# Altium schematic sheet TIDA-010056_Page1.SchDoc (part 2 of 2)
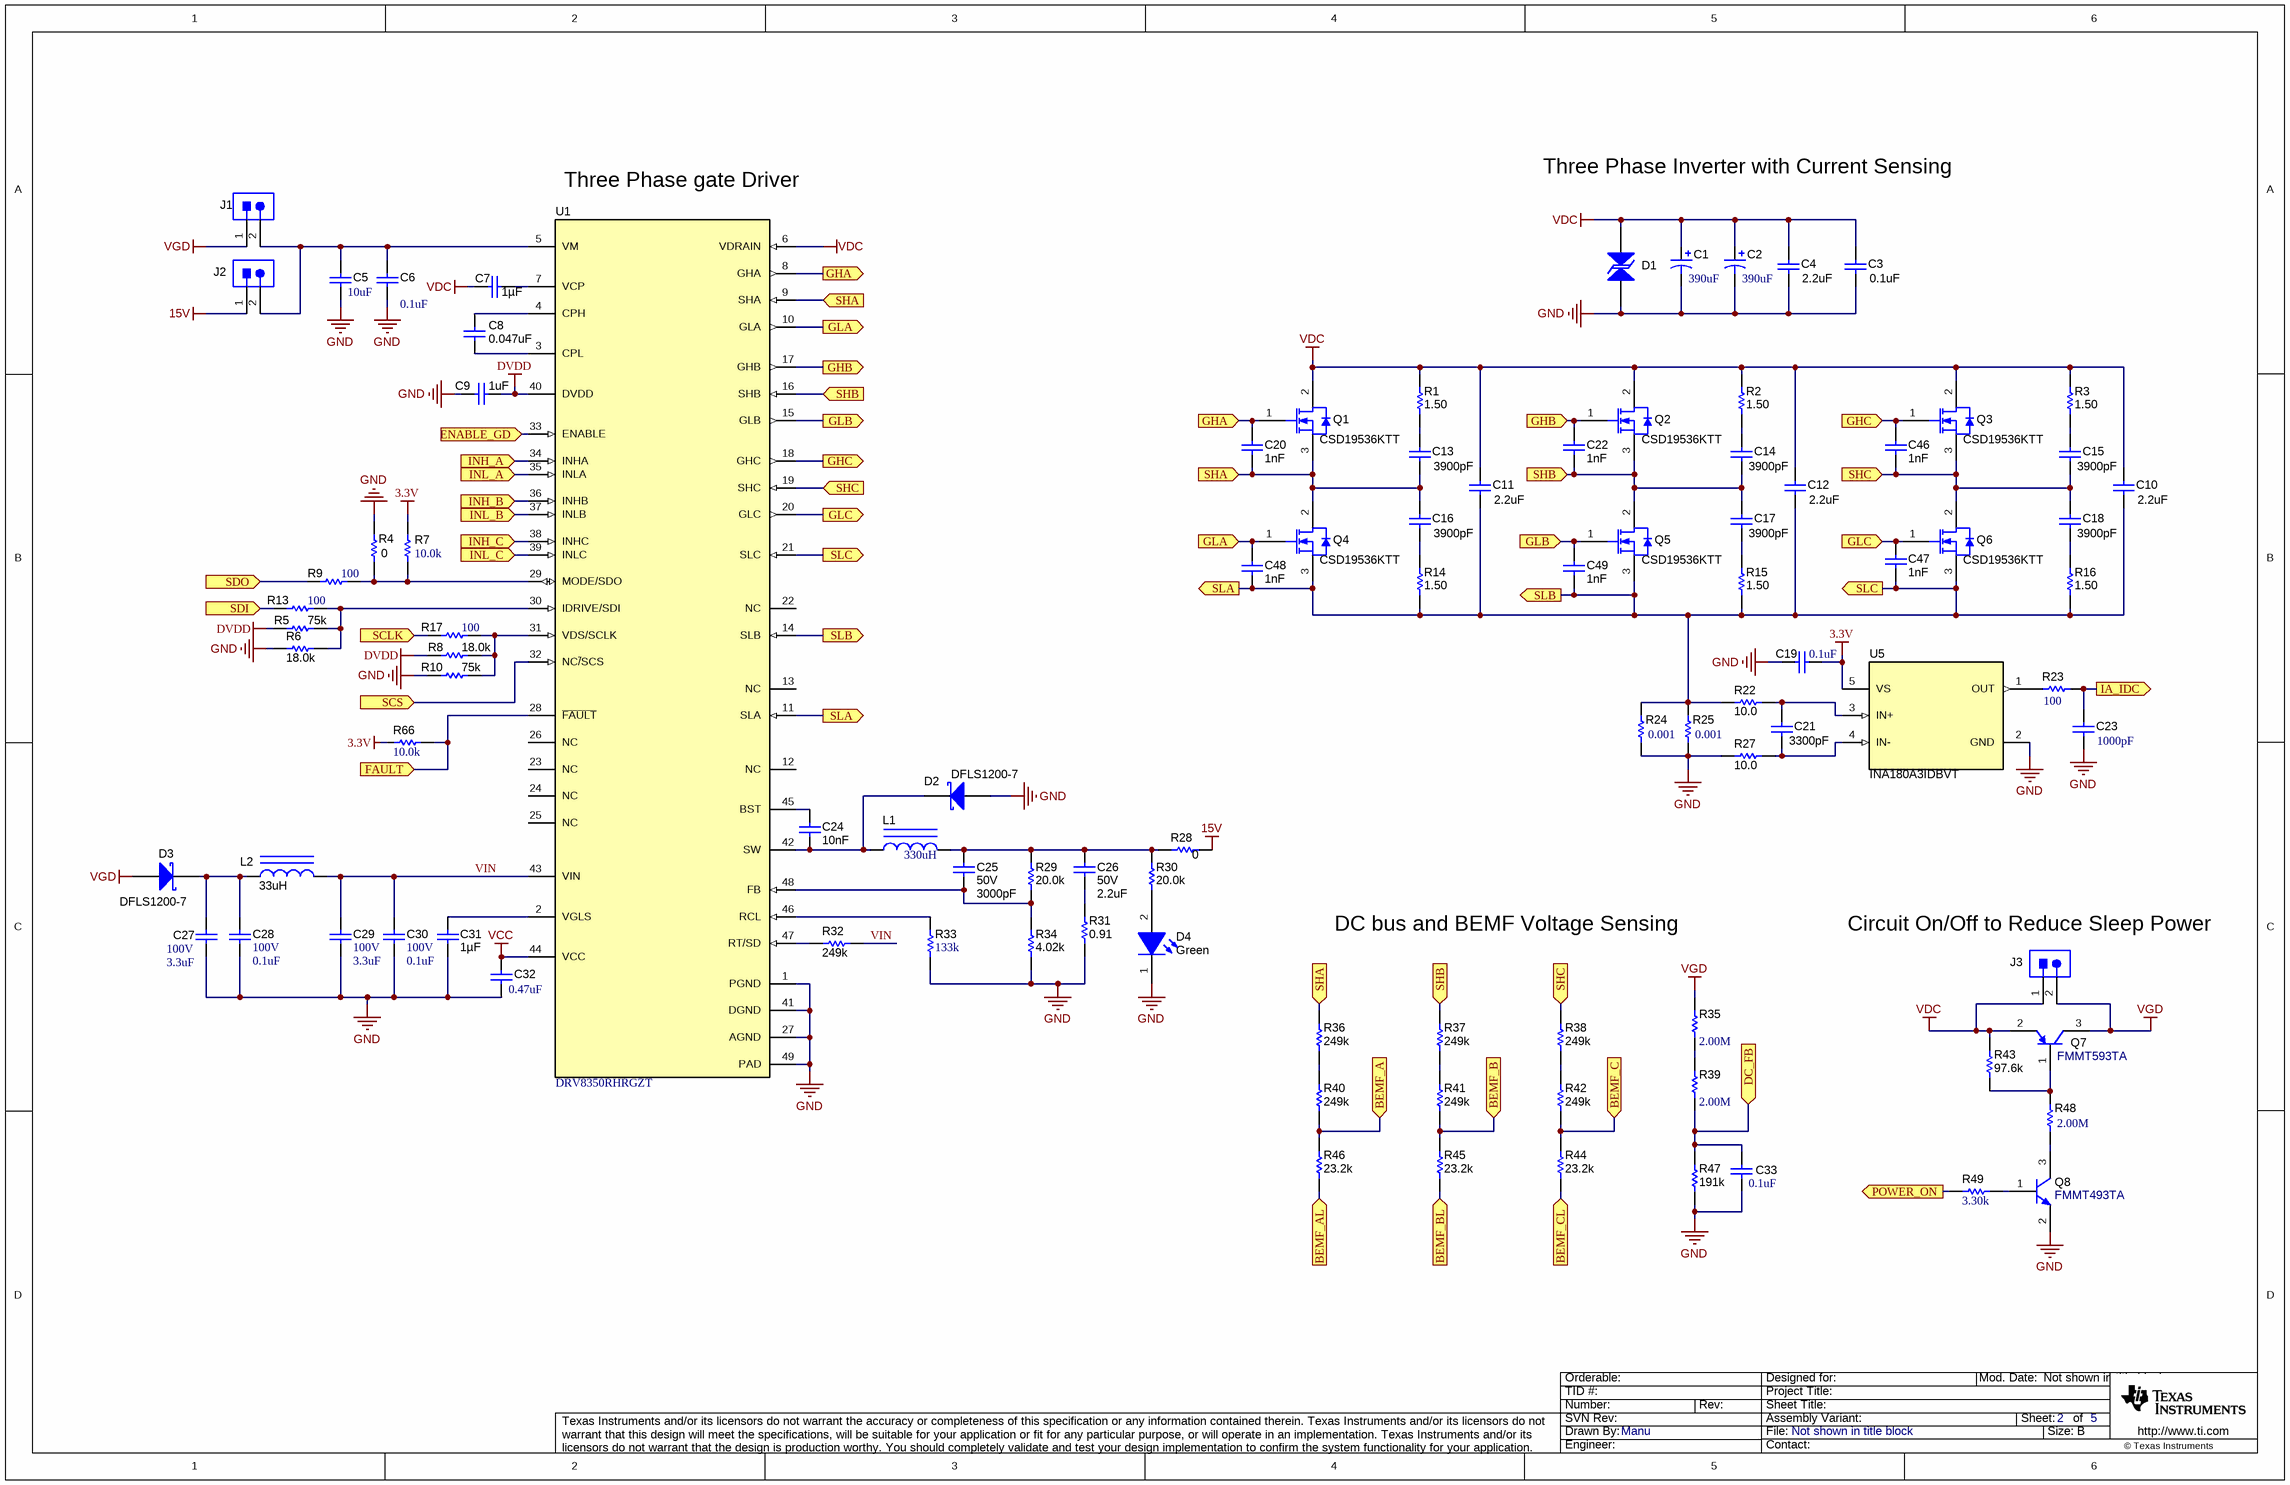
[diagram p1: TIDA-010056_Page1.SchDoc]

## Library data of the parts
C1 C2 = CMP-0009783-2: CAP ALUM 390UF 20% 100V THRUHOLE; Manufacturer: Panasonic Electronic Components; TaMin_C: -40°C; ESR_ohm: 0.025; Polarized: Y; SizeAreaWB_mm2: 324; Value1: 0.025 ohm; U/M: EA; TaMax_C: 105°C; SizeZ_mm: 27; SizeX_mm: 16; Cap_Case: 16x257; SizeArea_mm2: 256; CompType: Capacitor; AEC Qualified: N; Cap_F: 390µF; IRMS_A: 2.5A; AEC Category: Q200; Publisher: Texas Instruments; Supplier 2: Newark; Supplier 3: Farnell; RoHS: Y; MountType: TH; Value: 390uF; Supplier 1: Digi-Key; PackageReference: D16xL27mm; Tolerance_%: 20%; SizeY_mm: 16; Value2: 100V; LatestRevisionDate: 2017-03-09; PartNumber: EEU-FS2A391; Series: YXJ; VDC_V: 100V; ComponentLink1Description: Datasheet link; AEC Grade: N/A; Supplier Part Number 1: PCE5237-ND; Technology: AL; ComponentLink1URL: http://www.rubycon.co.jp/en/catalog/e_pdfs/aluminum/e_yxj.pdf; Parameter 1: *
C3 = CMP-0008709-2: CAP, CERM, 0.1 uF, 100 V, +/- 10%, X7R, 1206; Manufacturer: TDK; TaMin_C: -55°C; ESR_ohm: 0.030343; Polarized: N; SizeAreaWB_mm2: 10.92; Value1: 0.030343 ohm; U/M: EA; Value: 0.1uF; TaMax_C: 125°C; SizeZ_mm: 1.8; SizeX_mm: 3.2; SizeY_mm: 1.6; Value2: 100V; SizeArea_mm2: 5.12; Cap_F: 100nF; IRMS_A: 1.33802A; AEC Category: Q200; Supplier Part Number 2: 810-C3216X7R2A104K160AA; Publisher: Texas Instruments; Supplier 2: Mouser; TempCo: X7R; Published: 2008-06-19; RoHS: Y; MountType: SMT; Supplier 1: Digi-Key; PackageReference: 1206; Tolerance_%: 10%; Cap_Case: 1206_180; CompType: Capacitor; LatestRevisionDate: 2017-03-09; PartNumber: C3216X7R2A104K160AA; AEC Qualified: N; VDC_V: 100V; ComponentLink1Description: Datasheet link; AEC Grade: N/A; Supplier Part Number 1: 445-1377-1-ND; Technology: Ceramic; ComponentLink1URL: https://product.tdk.com/en/search/capacitor/ceramic/mlcc/info?part_no=C3216X7R2A104K160AA
C4 C10-C12 = CMP-0008756-2: CAP CER 2.2UF 100V X7R 1206; Manufacturer: Samsung Electro-Mechanics; TaMin_C: -55°C; Polarized: N; SizeAreaWB_mm2: 10.92; Value1: Unknown; U/M: EA; TaMax_C: 125°C; Tolerance_%: 10%; SizeZ_mm: 1.35; SizeX_mm: 3.2; SizeY_mm: 1.6; SizeArea_mm2: 5.12; AEC Category: Q200; Publisher: Texas Instruments; Supplier 2: Mouser; TempCo: X7R; Supplier 3: Farnell; Published: 2008-06-19; RoHS: Y; MountType: SMT; Value: 2.2uF; Supplier 1: Digi-Key; PackageReference: 1206; Cap_Case: 1206; Value2: 100V; CompType: Capacitor; LatestRevisionDate: 2017-03-09; PartNumber: CL31B225KCHSNNE; AEC Qualified: ?; Cap_F: 2.2uF; VDC_V: 100V; ComponentLink1Description: Datasheet link; Supplier Part Number 1: 1276-3138-1-ND; Technology: Ceramic; ComponentLink1URL: http://www.yageo.com/documents/recent/UPY-GPHC_X7R_6.3V-to-50V_7.pdf
C5 = CMP-0009304-2: CAP, CERM, 10 uF, 100 V, +/- 20%, X7R, 2220; Manufacturer: AVX; TaMin_C: -55°C; Polarized: N; SizeAreaWB_mm2: 53.9; Value1: Unknown; U/M: EA; Value: 10uF; TaMax_C: 125°C; SizeZ_mm: 2.8; SizeX_mm: 5.7; SizeY_mm: 5; Cap_Case: 2220; Value2: 100V; SizeArea_mm2: 28.5; Cap_F: 10µF; AEC Category: Q200; Supplier Part Number 2: 581-22201C106MAT2A; Publisher: Texas Instruments; Supplier 2: Mouser; TempCo: X7R; Published: 2008-06-19; RoHS: Y; MountType: SMT; Supplier 1: Digi-Key; PackageReference: 2220; Tolerance_%: 20%; CompType: Capacitor; LatestRevisionDate: 2017-03-09; PartNumber: 22201C106MAT2A; AEC Qualified: N; ComponentLink1Description: Datasheet link; AEC Grade: N/A; Supplier Part Number 1: 478-9622-1-ND; Technology: Ceramic; ComponentLink1URL: http://datasheets.avx.com/X7RDielectric.pdf
C6 = CMP-0007469-4: CAP, CERM, 0.1 uF, 100 V, +/- 10%, X7R, 0603; Manufacturer: MuRata; TaMin_C: -55°C; Polarized: N; SizeAreaWB_mm2: 4.68; Value1: Unknown; U/M: EA; Value: 0.1uF; TaMax_C: 125°C; SizeZ_mm: 1; SizeX_mm: 1.6; SizeY_mm: 0.8; Value2: 100V; SizeArea_mm2: 1.28; Cap_F: 100nF; AEC Category: Q200; Supplier Part Number 2: 81-GRM188R72A104KA35; Publisher: Texas Instruments; Supplier 2: Mouser; Supplier Part Number 3: 1828921; TempCo: X7R; Supplier 3: Farnell; Published: 2008-06-19; RoHS: Y; MountType: SMT; Supplier 1: Digi-Key; PackageReference: 0603; Tolerance_%: 10%; Cap_Case: 0603; CompType: Capacitor; LatestRevisionDate: 2017-03-09; PartNumber: GRM188R72A104KA35D; AEC Qualified: ?; VDC_V: 100V; ComponentLink1Description: Datasheet link; Supplier Part Number 1: 490-3285-1-ND; Technology: Ceramic; ComponentLink1URL: http://search.murata.co.jp/Ceramy/PnsearchViewAction.do?HnOFG=ON&HnNFG=ON&SEL_CNT=50&sLang=en&sKey=GRM188R72A104KA35D&x=9&y=9&search=startwith
C7 C31 = CMP-0086009-1: CAP, CERM, 1 µF, 16 V,+/- 20%, X5R, 0402; Manufacturer: Samsung Electro-Mechanics; SizeX_mm: 1; AEC Qualified: N; TaMin_C: -55°C; Value2: 16V; SizeY_mm: 0.5; Value: 1uF; SizeAreaWB_mm2: 3; U/M: EA; AEC Category: Q200; TaMax_C: 85°C; SizeZ_mm: 0.6; Technology: Ceramic; Cap_Case: 0402; Polarized: N; TempCo: X5R; CompType: Capacitor; ComponentLink1URL: http://www.samsungsem.com/kr/support/library/product-catalog/__icsFiles/afieldfile/2018/11/28/MLCC.pdf; AEC Grade: N/A; ComponentLink1Description: Datasheet link; PackageReference: 0402; PartNumber: CL05A105MO5NNNC; Tolerance_%: 20%; SizeArea_mm2: 0.5; VDC_V: 16V; RoHS: Y; Cap_F: 1µF; MountType: SMT
C8 = CMP-0008373-2: CAP, CERM, 0.047 uF, 100 V, +/- 10%, X7R, 0805; Manufacturer: MuRata; TaMin_C: -55°C; Polarized: N; SizeAreaWB_mm2: 6.75; Value1: Unknown; U/M: EA; TaMax_C: 125°C; SizeZ_mm: 1.45; SizeX_mm: 2; SizeY_mm: 1.25; Cap_Case: 0805; Value2: 100V; SizeArea_mm2: 2.5; CompType: Capacitor; Cap_F: 47nF; AEC Category: Q200; Supplier Part Number 2: 81-GRM21BR72A473KA1L; Publisher: Texas Instruments; Supplier 2: Mouser; Supplier Part Number 3: 1403974; TempCo: X7R; Supplier 3: Farnell; Published: 2008-06-19; RoHS: Y; MountType: SMT; Value: 0.047uF; Supplier 1: Digi-Key; PackageReference: 0805; Tolerance_%: 10%; LatestRevisionDate: 2017-03-09; PartNumber: GRM21BR72A473KA01L; AEC Qualified: ?; VDC_V: 100V; ComponentLink1Description: Datasheet link; Supplier Part Number 1: 490-3325-1-ND; Technology: Ceramic; ComponentLink1URL: http://search.murata.co.jp/Ceramy/PnsearchViewAction.do?HnOFG=ON&HnNFG=ON&SEL_CNT=50&sLang=en&sKey=GRM21BR72A473KA01L&x=9&y=9&search=startwith
C9 = CMP-0006372-2: CAP, CERM, 1 uF, 6.3 V, +/- 20%, X5R, 0402; Manufacturer: MuRata; TaMin_C: -55°C; Polarized: N; SizeAreaWB_mm2: 3; Value1: Unknown; U/M: EA; Value: 1uF; TaMax_C: 85°C; SizeZ_mm: 0.6; SizeX_mm: 1; SizeY_mm: 0.5; Value2: 6.3V; CompType: Capacitor; Cap_F: 1µF; AEC Category: Q200; Supplier Part Number 2: 81-GRM152R60J105ME5D; Publisher: Texas Instruments; Supplier 2: Mouser; TempCo: X5R; Published: 2008-06-19; RoHS: Y; MountType: SMT; Supplier 1: Digi-Key; PackageReference: 0402; Tolerance_%: 20%; Cap_Case: 0402; SizeArea_mm2: 0.5; LatestRevisionDate: 2017-03-09; PartNumber: GRM152R60J105ME15D; AEC Qualified: ?; VDC_V: 6.3V; ComponentLink1Description: Datasheet link; Supplier Part Number 1: 490-10006-1-ND; Technology: Ceramic; ComponentLink1URL: http://psearch.murata.com/capacitor/product/GRM152R60J105ME15%23.pdf
C13-C18 = CMP-0008756-2: CAP CER 3900PF 100V X7R 1206; Manufacturer: AVX Corporation; TaMin_C: -55°C; Polarized: N; SizeAreaWB_mm2: 10.92; Value1: Unknown; U/M: EA; TaMax_C: 125°C; Tolerance_%: 10%; SizeZ_mm: 1.35; SizeX_mm: 3.2; SizeY_mm: 1.6; SizeArea_mm2: 5.12; Cap_F: 3.9nF; AEC Category: Q200; Publisher: Texas Instruments; Supplier 2: Mouser; TempCo: X7R; Supplier 3: Farnell; Published: 2008-06-19; RoHS: Y; MountType: SMT; Value: 3900pF; Supplier 1: Digi-Key; PackageReference: 1206; Cap_Case: 1206; Value2: 100V; CompType: Capacitor; LatestRevisionDate: 2017-03-09; PartNumber: 12061C392KAZ2A; AEC Qualified: ?; VDC_V: 100V; ComponentLink1Description: Datasheet link; Supplier Part Number 1: 478-6364-1-ND; Technology: Ceramic; ComponentLink1URL: http://www.yageo.com/documents/recent/UPY-GPHC_X7R_6.3V-to-50V_7.pdf
C19 C33 = CMP-0006350-2: CAP, CERM, 0.1 uF, 10 V, +/- 10%, X7R, AEC-Q200 Grade 1, 0402; Manufacturer: MuRata; TaMin_C: -55°C; Polarized: N; SizeAreaWB_mm2: 3; Value1: Unknown; U/M: EA; Value: 0.1uF; TaMax_C: 125°C; SizeZ_mm: 0.6; SizeX_mm: 1; SizeY_mm: 0.5; Value2: 10V; AEC Qualified: Y; Cap_F: 100nF; AEC Category: Q200; Publisher: Texas Instruments; TempCo: X7R; Published: 2008-06-19; RoHS: Y; MountType: SMT; Supplier 1: Mouser; PackageReference: 0402; Tolerance_%: 10%; Cap_Case: 0402; SizeArea_mm2: 0.5; CompType: Capacitor; LatestRevisionDate: 2017-03-09; PartNumber: GCM155R71A104KA55D; VDC_V: 10V; ComponentLink1Description: Datasheet link; AEC Grade: 1; Supplier Part Number 1: 81-GCM155R71A104K5D; Technology: Ceramic; ComponentLink1URL: http://search.murata.co.jp/Ceramy/image/img/A01X/G101/ENG/GCM155R71A104KA55-01.pdf
C20 C22 C46-C49 = CMP-0064933-1: CAP, CERM, 1000 pF, 50 V,+/- 10%, X7R, 0603; Manufacturer: Wurth Elektronik; TaMin_C: -55°C; Polarized: N; SizeAreaWB_mm2: 4.68; Value1: Unknown; U/M: EA; Value: 1000pF; TaMax_C: 125°C; SizeZ_mm: 1; SizeX_mm: 1.6; SizeY_mm: 0.8; Value2: 50V; SizeArea_mm2: 1.28; AEC Category: Q200; ComponentLink1URL: http://katalog.we-online.de/pbs/datasheet/885012206083.pdf; Supplier Part Number 2: 75Y6033; Publisher: Texas Instruments; Supplier 2: Newark; Supplier Part Number 3: 710-885012206083; TempCo: X7R; Supplier 3: Mouser; Published: 2008-06-19; RoHS: Y; MountType: SMT; Supplier 1: Digi-Key; PackageReference: 0603; Tolerance_%: 10%; Cap_Case: 0603; CompType: Capacitor; LatestRevisionDate: 2017-06-05; PartNumber: 885012206083; AEC Qualified: N; VDC_V: 50V; ComponentLink1Description: Datasheet link; AEC Grade: N/A; Supplier Part Number 1: 732-8001-1-ND; Technology: Ceramic; ValueDisplayed: 1000pF
C21 = CMP-0006688-2: CAP, CERM, 3300 pF, 50 V, +/- 10%, X7R, 0402; Manufacturer: MuRata; TaMin_C: -55°C; Polarized: N; SizeAreaWB_mm2: 3; Value1: Unknown; U/M: EA; Value: 3300pF; TaMax_C: 125°C; SizeZ_mm: 0.6; SizeX_mm: 1; SizeY_mm: 0.5; Value2: 50V; Cap_F: 3.3nF; AEC Category: Q200; Supplier Part Number 2: 81-GRM36X332K50; Publisher: Texas Instruments; Supplier 2: Mouser; TempCo: X7R; Published: 2008-06-19; RoHS: Y; MountType: SMT; Supplier 1: Digi-Key; PackageReference: 0402; Tolerance_%: 10%; Cap_Case: 0402; SizeArea_mm2: 0.5; CompType: Capacitor; LatestRevisionDate: 2017-03-09; PartNumber: GRM155R71H332KA01D; AEC Qualified: ?; VDC_V: 50V; ComponentLink1Description: Datasheet link; Supplier Part Number 1: 490-3248-1-ND; Technology: Ceramic; ComponentLink1URL: http://search.murata.co.jp/Ceramy/PnsearchViewAction.do?HnOFG=ON&HnNFG=ON&SEL_CNT=50&sLang=en&sKey=GRM155R71H332KA01D&x=9&y=9&search=startwith
C23 = CMP-0006638-2: CAP, CERM, 1000 pF, 16 V, +/- 10%, X7R, 0402; Manufacturer: MuRata; TaMin_C: -55°C; Polarized: N; SizeAreaWB_mm2: 3; Value1: Unknown; U/M: EA; Value: 1000pF; TaMax_C: 125°C; SizeZ_mm: 0.6; SizeX_mm: 1; SizeY_mm: 0.5; Value2: 16V; Cap_F: 1nF; AEC Category: Q200; Supplier Part Number 2: 81-GRM155R71C102KA1D; Publisher: Texas Instruments; Supplier 2: Mouser; TempCo: X7R; Published: 2008-06-19; RoHS: Y; MountType: SMT; Supplier 1: Digi-Key; PackageReference: 0402; Tolerance_%: 10%; Cap_Case: 0402; SizeArea_mm2: 0.5; CompType: Capacitor; LatestRevisionDate: 2017-03-09; PartNumber: GRM155R71C102KA01D; AEC Qualified: ?; VDC_V: 16V; ComponentLink1Description: Datasheet link; Supplier Part Number 1: GRM155R71C102KA01D-ND; Technology: Ceramic; ComponentLink1URL: http://search.murata.co.jp/Ceramy/PnsearchViewAction.do?HnOFG=ON&HnNFG=ON&SEL_CNT=50&sLang=en&sKey=GRM155R71C102KA01D&x=9&y=9&search=startwith
C24 = CMP-0079993-1: CAP, CERM, 0.01 µF, 100 V,+/- 10%, X7R, 0603; Manufacturer: Wurth Elektronik; TaMin_C: -55°C; Polarized: N; SizeAreaWB_mm2: 4.68; U/M: EA; Value: 0.01uF; TaMax_C: 105°C; SizeZ_mm: 1; SizeX_mm: 1.6; SizeY_mm: 0.8; Value2: 100V; SizeArea_mm2: 1.28; AEC Category: Q200; ValueDisplayed: 0.01µF; ComponentLink1URL: http://katalog.we-online.de/pbs/datasheet/885012206114.pdf; Supplier Part Number 2: 2812368; Supplier 2: Farnell; TempCo: X7R; RoHS: Y; MountType: SMT; Supplier 1: Newark; PackageReference: 0603; Tolerance_%: 10%; Cap_Case: 0603; CompType: Capacitor; PartNumber: 885012206114; AEC Qualified: N; VDC_V: 100V; ComponentLink1Description: Datasheet link; AEC Grade: N/A; Supplier Part Number 1: 45AC8565; Technology: Ceramic
C25 = CMP-0007207-4: CAP, CERM, 3000 pF, 50 V, +/- 5%, C0G/NP0, 0603; Manufacturer: MuRata; TaMin_C: -55°C; Polarized: N; SizeAreaWB_mm2: 4.68; Value1: Unknown; U/M: EA; Value: 3000pF; TaMax_C: 125°C; SizeZ_mm: 1; SizeX_mm: 1.6; SizeY_mm: 0.8; SizeArea_mm2: 1.28; Cap_F: 3nF; AEC Category: Q200; Supplier Part Number 2: 81-GRM1885C1H302JA1D; Publisher: Texas Instruments; Supplier 2: Mouser; TempCo: C0G/NP0; Published: 2008-06-19; RoHS: Y; MountType: SMT; Supplier 1: Digi-Key; PackageReference: 0603; Tolerance_%: 5%; Cap_Case: 0603; Value2: 50V; CompType: Capacitor; LatestRevisionDate: 2017-03-09; PartNumber: GRM1885C1H302JA01D; AEC Qualified: ?; ComponentLink1Description: Datasheet link; Supplier Part Number 1: GRM1885C1H302JA01D-ND; Technology: Ceramic; ComponentLink1URL: http://search.murata.co.jp/Ceramy/PnsearchViewAction.do?HnOFG=ON&HnNFG=ON&SEL_CNT=50&sLang=en&sKey=GRM1885C1H302JA01D&x=9&y=9&search=startwith
C26 = CMP-0007877-2: CAP, CERM, 2.2 uF, 50 V, +/- 10%, X7R, 0805; Manufacturer: TDK; TaMin_C: -55°C; ESR_ohm: 3.66m; Polarized: N; SizeAreaWB_mm2: 6.75; Value1: 0.00366 ohm; U/M: EA; Value: 2.2uF; TaMax_C: 125°C; SizeZ_mm: 1.45; SizeX_mm: 2; SizeY_mm: 1.25; Cap_Case: 0805; SizeArea_mm2: 2.5; Cap_F: 2.2µF; IRMS_A: 3.41207A; AEC Category: Q200; Supplier Part Number 2: 04X3290; Publisher: Texas Instruments; Supplier 2: Newark; Supplier Part Number 3: 2346945; TempCo: X7R; Supplier 3: Farnell; Published: 2008-06-19; RoHS: Y; MountType: SMT; Supplier 1: Digi-Key; PackageReference: 0805; Tolerance_%: 10%; Value2: 50V; CompType: Capacitor; LatestRevisionDate: 2017-03-09; PartNumber: C2012X7R1H225K125AC; AEC Qualified: N; ComponentLink1Description: Datasheet link; AEC Grade: N/A; Supplier Part Number 1: 445-5968-1-ND; Technology: Ceramic; ComponentLink1URL: https://product.tdk.com/en/search/capacitor/ceramic/mlcc/info?part_no=C2012X7R1H225K125AC
C27 C29 = CMP-0008725-2: CAP, CERM, 3.3 uF, 100 V, +/- 20%, X7S, 1206_190; Manufacturer: TDK; TaMin_C: -55°C; ESR_ohm: 3.048m; Polarized: N; SizeAreaWB_mm2: 10.92; Value1: 0.003048 ohm; U/M: EA; Value: 3.3uF; TaMax_C: 125°C; SizeZ_mm: 1.9; SizeX_mm: 3.2; SizeY_mm: 1.6; SizeArea_mm2: 5.12; Cap_F: 3.3µF; IRMS_A: 4.15703A; AEC Category: Q200; Supplier Part Number 2: 46W3988; Publisher: Texas Instruments; Supplier 2: Newark; TempCo: X7S; Published: 2008-06-19; RoHS: Y; MountType: SMT; Supplier 1: Digi-Key; PackageReference: 1206_190; Tolerance_%: 20%; Cap_Case: 1206_190; Value2: 100V; CompType: Capacitor; LatestRevisionDate: 2017-03-09; PartNumber: C3216X7S2A335M160AB; AEC Qualified: N; ComponentLink1Description: Datasheet link; AEC Grade: N/A; Supplier Part Number 1: 445-9234-1-ND; Technology: Ceramic; ComponentLink1URL: https://product.tdk.com/en/search/capacitor/ceramic/mlcc/info?part_no=C3216X7S2A335M160AB
C28 C30 = CMP-0007469-4: CAP, CERM, 0.1 uF, 100 V, +/- 10%, X7R, 0603; Manufacturer: MuRata; TaMin_C: -55°C; Polarized: N; SizeAreaWB_mm2: 4.68; Value1: Unknown; U/M: EA; Value: 0.1uF; TaMax_C: 125°C; SizeZ_mm: 1; SizeX_mm: 1.6; SizeY_mm: 0.8; SizeArea_mm2: 1.28; Cap_F: 100nF; AEC Category: Q200; Supplier Part Number 2: 81-GRM188R72A104KA35; Publisher: Texas Instruments; Supplier 2: Mouser; Supplier Part Number 3: 1828921; TempCo: X7R; Supplier 3: Farnell; Published: 2008-06-19; RoHS: Y; MountType: SMT; Supplier 1: Digi-Key; PackageReference: 0603; Tolerance_%: 10%; Cap_Case: 0603; Value2: 100V; CompType: Capacitor; LatestRevisionDate: 2017-03-09; PartNumber: GRM188R72A104KA35D; AEC Qualified: ?; ComponentLink1Description: Datasheet link; Supplier Part Number 1: 490-3285-1-ND; Technology: Ceramic; ComponentLink1URL: http://search.murata.co.jp/Ceramy/PnsearchViewAction.do?HnOFG=ON&HnNFG=ON&SEL_CNT=50&sLang=en&sKey=GRM188R72A104KA35D&x=9&y=9&search=startwith
C32 = CMP-0006600-2: CAP CER 0.47UF 16V X5R 0402; Manufacturer: TDK Corporation; TaMin_C: -55°C; Polarized: N; SizeAreaWB_mm2: 3; Value1: Unknown; U/M: EA; TaMax_C: 85°C; Tolerance_%: 10%; SizeZ_mm: 0.6; SizeX_mm: 1; SizeY_mm: 0.5; Cap_F: 470nF; AEC Category: Q200; Publisher: Texas Instruments; TempCo: X5R; Published: 2008-06-19; RoHS: Y; MountType: SMT; Value: 0.47uF; PackageReference: 0402; Cap_Case: 0402; Value2: 16V; SizeArea_mm2: 0.5; CompType: Capacitor; LatestRevisionDate: 2017-03-09; PartNumber: CGB2A1X5R1C474K033BC; AEC Qualified: ?; VDC_V: 16V; ComponentLink1Description: Datasheet link; Technology: Ceramic; ComponentLink1URL: http://psearch.murata.com/capacitor/product/GRM155R61C474KE01%23.pdf; Supplier 1: Digikey; Supplier Part Number 1: 445-13183-1-ND
D1 = CMP-0005587-3: Diode, TVS, Bi, 70 V, SMB; Manufacturer: Diodes Inc.; Value: 70V; AEC Category: Q101; SizeX_mm: 5.6; SizeY_mm: 3.81; Ppk: 600W; SizeZ_mm: 2.6; SizeArea_mm2: 21.336; SizeAreaWB_mm2: 44.156; PackageReference: SMB; PartNumber: SMBJ70CA-13-F; AEC Qualified: ?; ComponentLink1URL: http://www.diodes.com/datasheets/ds19002.pdf; CompType: TVS; RoHS: Y; MountType: SMT; Value1: 600W; VRWM: 70V; ComponentLink1Description: Datasheet link
D2 D3 = CMP-0028517-1: Diode, Schottky, 200 V, 1 A, PowerDI123; Manufacturer: Diodes Inc.; Io_A: 1A; Green_Lifecycle: Active; SizeAreaWB_mm2: 13.066; Vr_V: 200V; Green_REACh: Passed; TJmax_C: 175°C; U/M: EA; Value: 200V; SizeZ_mm: 0.98; SizeX_mm: 3.7; SizeY_mm: 1.78; Vf_V: 8.5dV; Value2: 0.85V; SizeArea_mm2: 6.586; AEC Category: Q101; RJC_CperW: 7; ComponentLink1URL: http://www.diodes.com/datasheets/ds30628.pdf; Supplier Part Number 2: 621-DFLS1200-F; Publisher: Texas Instruments; Supplier 2: Mouser; Supplier Part Number 3: 1713890; Supplier 3: Farnell; Published: 2008-06-26; RoHS: Y; Value1: 1A; MountType: SMT; Green_EU RoHS-2: Passed; Supplier 1: Digi-Key; Green_EU RoHS: Passed with Exemption; PackageReference: PowerDI123; CompType: Diode; Type: Schottky; LatestRevisionDate: 2017-05-08; PartNumber: DFLS1200-7; AEC Qualified: ?; ComponentLink1Description: Datasheet link; Supplier Part Number 1: DFLS1200DICT-ND
D4 = CMP-0002905-1: LED, Green, SMD; Manufacturer: Wurth Elektronik; PartNumber: 150060GS75000; Type: InGaN; Vf_V: 3.2V; Io_A: 20mA; Tjmax_C: 85°C; Value1: W; Angle: 140; U/M: EA; CompType: LED; MountType: SMT; RoHS: Y; PackageReference: LED_0603; Value2: 3.2V; Color: Green; Published: 2008-07-11; Publisher: Texas Instruments; ComponentLink1URL: http://katalog.we-online.de/led/datasheet/150060GS75000.pdf; ComponentLink1Description: Datasheet link; LatestRevisionDate: 2017-03-09; Supplier 1: Digi-Key; Supplier Part Number 1: 732-4971-1-ND; Supplier 2: Newark; Supplier Part Number 2: 95W3794; Supplier 3: Mouser; Supplier Part Number 3: 710-150060GS75000
J1-J3 = CMP-0054794-2: Header, 2.54 mm, 2x1, Gold, TH; Manufacturer: Wurth Elektronik; Shrouded: N; Gender: Male; Green_REACh: Passed; Pitch_mm: 2.54; Green_Lifecycle: Active; Row_Count: 1; Cert_UL: Y; Supplier Part Number 2: 20X0948; Orientation: Vertical; PinCount: 2; ClassName: Header; Supplier 2: Newark; PackageReference: Header, 2.54mm, 2x1, TH; CompType: Header; ComponentLink1Description: Datasheet URL; Supplier 1: Digi-Key; Green_EU RoHS-2: Incomplete; ComponentLink1URL: http://katalog.we-online.de/em/datasheet/6130xx11121.pdf; Green_EU RoHS: Passed; MountType: TH; Supplier Part Number 3: 710-61300211121; RoHS: Y; Supplier Part Number 1: 732-5315-ND; ContactFinish: Gold; Supplier 3: Mouser; PartNumber: 61300211121; Color: Black
L1 = CMP-0056063-1: Inductor, Drum Core, Ferrite, 330 uH, 0.27 A, 2.25 ohm, SMD; Manufacturer: Bourns; Isat: 0.42A @ 10% inductance drop; Irms: 0.27A @ 40C rise; Green_Lifecycle: Active; SizeAreaWB_mm2: 60.84; DCR_ohm: 2.25; Green_REACh: Passed; Value: 330uH; Imax_A: 270mA; SizeZ_mm: 4.8; SizeX_mm: 5.8; Value2: 0.27A; SizeArea_mm2: 33.64; Ind_H: 330µH; AEC Category: Q200; ComponentLink1URL: http://www.bourns.com/data/global/pdfs/SDR0604.pdf; Supplier Part Number 2: 1828017; Publisher: Texas Instruments; Supplier 2: Farnell; Published: 2008-06-26; RoHS: Y; Value1: 2.25 ohm; Material: Ferrite; MountType: SMT; Green_EU RoHS-2: Incomplete; Supplier 1: Mouser; Green_EU RoHS: Passed; PackageReference: 5.8x4.8x5.8mm; SizeY_mm: 5.8; CompType: Inductor; LatestRevisionDate: 2017-06-02; PartNumber: SDR0604-331KL; AEC Qualified: ?; ComponentLink1Description: Datasheet link; Supplier Part Number 1: 652-SDR0604-331KL; Technology: Drum Core
L2 = CMP-0062507-2: Inductor, Shielded, Ferrite, 33 uH, 0.085 A, 1.4 ohm, SMD; PartNumber: NLFV25T-330K-PF; Manufacturer: TDK; Value: 33uH; Ind_H: 33µH; Imax_A: 85mA; Irms: 0.085A @ 20C rise; Isat: 0.085A @ 10% inductance drop; DCR_ohm: 1.4; Value1: 1.4 ohm; Value2: 0.085A; AEC Category: Q200; Green_Lifecycle: Active; Green_REACh: Passed; SizeArea_mm2: 4.5; SizeAreaWB_mm2: 9.8; SizeX_mm: 2.5; SizeY_mm: 1.8; SizeZ_mm: 2; CompType: Inductor; Technology: Shielded; MountType: SMT; Material: Ferrite; PackageReference: 2.5x1.8x2mm; Published: 2008-06-26; Publisher: Texas Instruments; LatestRevisionDate: 2017-06-02; ComponentLink1Description: Datasheet link; ComponentLink1URL: http://www.tdk.co.jp/tefe02/e511_nl_02.pdf; RoHS: Y; Supplier 1: Digi-Key; Supplier Part Number 1: 445-1908-1-ND; Supplier 2: Mouser; Supplier Part Number 2: 810-NLFV25T-330K; AEC Qualified: ?; Green_EU RoHS-2: Incomplete; Green_EU RoHS: Passed with Exemption
Q1-Q6 = CMP-0000966-3: MOSFET, N-CH, 100 V, 200 A, KTT0002A (TO-263-2); Alternate Manufacturer: None; Manufacturer: Texas Instruments; SizeZ_mm: 4.7; ChType: N; Value2: 118 nC; VdsMax_V: 100V; SizeX_mm: 14.3; SizeY_mm: 10.16; Vgs_V: 20V; QgTyp_nC: 118; Value: 100V; SizeArea_mm2: 145.288; AEC Category: Q101; IdsMax_A: 200A; SizeAreaWB_mm2: 198.208; Supplier 2: Mouser; Supplier 1: Digi-Key; Supplier Part Number 1: 296-41136-1-ND; Supplier Part Number 2: 595-CSD19536KTT; PartNumber: CSD19536KTT; ComponentLink1Description: Datasheet link; CompType: MOSFET; AEC Qualified: N; RoHS: Y; PackageReference: KTT0002A; MountType: SMT; ComponentLink1URL: http://www.ti.com/lit/ds/symlink/csd19536ktt.pdf
Q7 = CMP-0000366-2: TRANS PNP 100V 1A SOT23-3; Manufacturer: Fairchild Semiconductor; TaMax_C: 150°C; Vcesat1_V: 250mV; SizeX_mm: 2.5; SizeY_mm: 3; TaMin_C: -55°C; CompType: BJT; SizeZ_mm: 1.1; AEC Qualified: N; SizeArea_mm2: 7.5; NPN: 0; PNP: 1; AEC Category: Q101; SizeAreaWB_mm2: 14; U/M: EA; Supplier 2: Mouser; Supplier 1: Digi-Key; Supplier Part Number 1: FMMT593CT-ND; Value1: 1 A; PartNumber: FMMT593TA; LatestRevisionDate: 2017-03-09; IcRated_A: 1 A; Publisher: Texas Instruments; ComponentLink1Description: Datasheet link; Value: 100 V; Published: 2008-07-31; RoHS: Y; Vceo_V: 100V; PackageReference: SOT-23; MountType: SMT; ComponentLink1URL: https://www.fairchildsemi.com/datasheets/BS/BSS63.pdf
Q8 = CMP-0000489-2: TRANS NPN 100V 1A SOT23-3; Manufacturer: Diodes Incorporated; TaMax_C: 150°C; Value2: 1200; Vcesat1_V: 600mV; SizeX_mm: 2.5; SizeY_mm: 3; TaMin_C: -55°C; CompType: BJT; SizeZ_mm: 1.1; AEC Qualified: N; SizeArea_mm2: 7.5; NPN: 1; PNP: 0; AEC Category: Q101; SizeAreaWB_mm2: 14; U/M: EA; Supplier 2: Newark; Supplier 3: Mouser; Supplier 1: Digi-Key; Supplier Part Number 1: FMMT493CT-ND; Value1: 1 A; PartNumber: FMMT493TA; LatestRevisionDate: 2017-03-09; IcRated_A: 1 A; Publisher: Texas Instruments; ComponentLink1Description: Datasheet link; HfeMax: 1200; Value: 100 V; Published: 2008-07-31; RoHS: Y; Vceo_V: 100V; PackageReference: SOT-23; MountType: SMT; ComponentLink1URL: https://sps06.itg.ti.com/sites/KMS/crossdivteams/altium/docs/ComponentDatasheets/DSC2C01_AED-21437.pdf
R1-R3 R14-R16 = CMP-0016763-3: RES, 1.50, 1%, 0.25 W, AEC-Q200 Grade 0, 1206; Manufacturer: Vishay-Dale; Power_W: 250mW; TempCo: 100 ppm/C; Value_Code: 1R50; Value: 1.50; EIA_Code: E96; Res_ohm: 1.5; SizeX_mm: 3.2; SizeY_mm: 1.6; SizeZ_mm: 1.35; Value2: 0.25W; SizeArea_mm2: 5.12; AEC Qualified: Y; VDC_V: 200V; AEC Category: Q200; AEC Grade: 0; Supplier Part Number 2: 71-CRCW1206-1.5-E3; Supplier 2: Mouser; Supplier Part Number 3: 1260858; Supplier 3: Farnell; RoHS: E; Value1: 1%; MountType: SMT; Supplier 1: Newark; PackageReference: 1206; Tolerance_%: 1%; CompType: Resistor; PartNumber: CRCW12061R50FKEA; ComponentLink1Description: Datasheet link; Supplier Part Number 1: 53K1888; Technology: Thick Film; ComponentLink1URL: http://www.vishay.com/docs/20035/dcrcwe3.pdf
R4 R28 = CMP-0027004-2: RES, 0, 5%, 0.063 W, 0402; Manufacturer: Yageo America; Power_W: 63mW; TempCo: 200 ppm/C; Value_Code: 0000; U/M: EA; Value: 0; EIA_Code: E24; SizeX_mm: 1; SizeY_mm: 0.5; SizeZ_mm: 0.6; Value2: 0.063W; VDC_V: 50V; AEC Category: Q200; Supplier Part Number 2: 603-RC0402JR-070RL; Publisher: Texas Instruments; Supplier 2: Mouser; Supplier Part Number 3: 9232516; Supplier 3: Farnell; Published: 2008-06-26; RoHS: Y; Value1: 5%; MountType: SMT; Supplier 1: Digi-Key; PackageReference: 0402; Tolerance_%: 5%; Res_ohm: 0; SizeArea_mm2: 0.5; CompType: Resistor; LatestRevisionDate: 2017-03-09; PartNumber: RC0402JR-070RL; AEC Qualified: ?; ComponentLink1Description: Datasheet link; Supplier Part Number 1: 311-0.0JRCT-ND; Technology: Thick Film; ComponentLink1URL: http://www.yageo.com/pdf/Pu-RC0402_51_PbFree_L_2.pdf
R5 R10 = CMP-0026973-3: RES, 75 k, 5%, 0.063 W, AEC-Q200 Grade 0, 0402; Manufacturer: Vishay-Dale; Power_W: 63mW; TempCo: 200 ppm/C; Value_Code: 75k0; Value: 75k; EIA_Code: E24; SizeX_mm: 1; SizeY_mm: 0.5; SizeZ_mm: 0.6; Value2: 0.063W; AEC Qualified: Y; VDC_V: 50V; AEC Category: Q200; AEC Grade: 0; Supplier Part Number 2: 89M6694; Supplier 2: Newark; Supplier Part Number 3: 71-CRCW040275K0JNED; Supplier 3: Mouser; RoHS: E; Value1: 5%; MountType: SMT; Supplier 1: Digi-Key; PackageReference: 0402; Tolerance_%: 5%; Res_ohm: 75k; SizeArea_mm2: 0.5; CompType: Resistor; PartNumber: CRCW040275K0JNED; ComponentLink1Description: Datasheet link; Supplier Part Number 1: 541-75KJCT-ND; Technology: Thick Film; ComponentLink1URL: http://www.vishay.com/docs/20035/dcrcwe3.pdf
R6 R8 = CMP-0081723-1: RES, 18.0 k, 1%, 0.1 W, AEC-Q200 Grade 0, 0402; Manufacturer: Panasonic; Power_W: 100mW; TempCo: 100 ppm/C; SizeAreaWB_mm2: 3; Value_Code: 18k0; Value: 18.0k; Res_ohm: 18k; SizeX_mm: 1; SizeY_mm: 0.5; SizeZ_mm: 0.6; Value2: 0.1W; AEC Qualified: Y; AEC Grade: 0; AEC Category: Q200; ComponentLink1URL: https://industrial.panasonic.com/cdbs/www-data/pdf/RDA0000/AOA0000C304.pdf; Supplier Part Number 2: 85Y8155; Supplier 2: Newark; Supplier Part Number 3: 667-ERJ-2RKF1802X; Supplier 3: Mouser; RoHS: Y; Value1: 1%; MountType: SMT; Supplier 1: Digi-Key; PackageReference: 0402; Tolerance_%: 1%; SizeArea_mm2: 0.5; CompType: Resistor; PartNumber: ERJ-2RKF1802X; ComponentLink1Description: Datasheet link; Supplier Part Number 1: P18.0KLCT-ND; Technology: Thick Film
R7 R66 = CMP-0026658-1: RES, 10.0 k, 1%, 0.1 W, 0402; Manufacturer: Panasonic; Power_W: 100mW; TempCo: 100 ppm/C; Value_Code: 10k0; U/M: EA; Value: 10.0k; EIA_Code: E96; Res_ohm: 10k; SizeX_mm: 1; SizeY_mm: 0.5; SizeZ_mm: 0.6; Value2: 0.1W; VDC_V: 50V; AEC Category: Q200; ComponentLink1URL: http://industrial.panasonic.com/www-data/pdf/AOA0000/AOA0000CE2.pdf; Supplier Part Number 2: 90W2949; Publisher: Texas Instruments; Supplier 2: Newark; Supplier Part Number 3: 667-ERJ-2RKF1002X; Supplier 3: Mouser; Published: 2008-06-26; RoHS: Y; Value1: 1%; MountType: SMT; Supplier 1: Digi-Key; PackageReference: 0402; Tolerance_%: 1%; SizeArea_mm2: 0.5; CompType: Resistor; LatestRevisionDate: 2017-03-09; PartNumber: ERJ-2RKF1002X; AEC Qualified: ?; ComponentLink1Description: Datasheet link; Supplier Part Number 1: P10.0KLCT-ND; Technology: Thick Film
R9 R13 R17 R23 = CMP-0026993-2: RES, 100, 5%, 0.1 W, AEC-Q200 Grade 0, 0402; Manufacturer: Panasonic; Power_W: 100mW; TempCo: 200 ppm/C; Value_Code: 100R; U/M: EA; Value: 100; EIA_Code: E24; SizeX_mm: 1; SizeY_mm: 0.5; SizeZ_mm: 0.6; Value2: 0.1W; AEC Qualified: Y; AEC Grade: 0; AEC Category: Q200; Supplier Part Number 2: 65T8246; Publisher: Texas Instruments; Supplier 2: Newark; Supplier Part Number 3: 2059210; Supplier 3: Farnell; Published: 2008-06-26; RoHS: Y; Value1: 5%; MountType: SMT; Supplier 1: Digi-Key; PackageReference: 0402; Tolerance_%: 5%; Res_ohm: 100; SizeArea_mm2: 0.5; CompType: Resistor; LatestRevisionDate: 2017-03-09; PartNumber: ERJ-2GEJ101X; ComponentLink1Description: Datasheet link; Supplier Part Number 1: P100JCT-ND; Technology: Thick Film; ComponentLink1URL: https://industrial.panasonic.com/cdbs/www-data/pdf/RDA0000/AOA0000C84.pdf
R22 R27 = CMP-0025963-3: RES, 10.0, 1%, 0.063 W, AEC-Q200 Grade 0, 0402; Manufacturer: Vishay-Dale; Power_W: 63mW; TempCo: 100 ppm/C; Value_Code: 10R0; Value: 10.0; EIA_Code: E96; Res_ohm: 10; SizeX_mm: 1; SizeY_mm: 0.5; SizeZ_mm: 0.6; Value2: 0.063W; AEC Qualified: Y; VDC_V: 50V; AEC Category: Q200; AEC Grade: 0; Supplier Part Number 2: 52K6600; Supplier 2: Newark; Supplier Part Number 3: 71-CRCW0402-10-E3; Supplier 3: Mouser; RoHS: E; Value1: 1%; MountType: SMT; Supplier 1: Digi-Key; PackageReference: 0402; Tolerance_%: 1%; SizeArea_mm2: 0.5; CompType: Resistor; PartNumber: CRCW040210R0FKED; ComponentLink1Description: Datasheet link; Supplier Part Number 1: 541-10.0LCT-ND; Technology: Thick Film; ComponentLink1URL: http://www.vishay.com/docs/20035/dcrcwe3.pdf
R24 = CMP-0015748-2: RES, 0.001, 1%, 3 W, AEC-Q200 Grade 0, 2512; Manufacturer: Bourns; Power_W: 3W; TempCo: 50 ppm/C; Value_Code: 1L000; U/M: EA; Value: 0.001; EIA_Code: E96; Res_ohm: 1m; SizeX_mm: 6.45; SizeY_mm: 3.35; SizeZ_mm: 0.9; SizeArea_mm2: 21.6075; AEC Qualified: Y; AEC Grade: 0; AEC Category: Q200; Supplier Part Number 2: 78X4866; Publisher: Texas Instruments; Supplier 2: Newark; Supplier Part Number 3: 652-CRE2512FZR001E-3; Supplier 3: Mouser; Published: 2008-06-26; RoHS: Y; Value1: 1%; MountType: SMT; Supplier 1: Digi-Key; PackageReference: 2512; Tolerance_%: 1%; Value2: 3W; CompType: Resistor; LatestRevisionDate: 2017-03-09; PartNumber: CRE2512-FZ-R001E-3; ComponentLink1Description: Datasheet link; Supplier Part Number 1: CRE2512-FZ-R001E-3CT-ND; Technology: Metal Film; ComponentLink1URL: http://www.bourns.com/docs/Product-Datasheets/CRE.pdf
R25 = CMP-0015748-2: RES, 0.001, 1%, 3 W, AEC-Q200 Grade 0, 2512; Manufacturer: Bourns; Power_W: 3W; TempCo: 50 ppm/C; Value_Code: 1L000; U/M: EA; EIA_Code: E96; Res_ohm: 1m; SizeX_mm: 6.45; SizeY_mm: 3.35; SizeZ_mm: 0.9; SizeArea_mm2: 21.6075; AEC Qualified: Y; AEC Grade: 0; AEC Category: Q200; Supplier Part Number 2: 78X4866; Publisher: Texas Instruments; Supplier 2: Newark; Supplier Part Number 3: 652-CRE2512FZR001E-3; Supplier 3: Mouser; Published: 2008-06-26; RoHS: Y; Value1: 1%; MountType: SMT; Supplier 1: Digi-Key; PackageReference: 2512; Tolerance_%: 1%; Value2: 3W; CompType: Resistor; LatestRevisionDate: 2017-03-09; PartNumber: CRE2512-FZ-R001E-3; ComponentLink1Description: Datasheet link; Supplier Part Number 1: CRE2512-FZ-R001E-3CT-ND; Technology: Metal Film; ComponentLink1URL: http://www.bourns.com/docs/Product-Datasheets/CRE.pdf
R29 R30 = CMP-0026162-2: RES, 20.0 k, 1%, 0.063 W, AEC-Q200 Grade 0, 0402; Manufacturer: Vishay-Dale; Power_W: 63mW; TempCo: 100 ppm/C; Value_Code: 20k0; Value: 20.0k; EIA_Code: E96; Res_ohm: 20k; SizeX_mm: 1; SizeY_mm: 0.5; SizeZ_mm: 0.6; Value2: 0.063W; AEC Qualified: Y; VDC_V: 50V; AEC Category: Q200; AEC Grade: 0; ComponentLink1URL: http://www.vishay.com/docs/20035/dcrcwe3.pdf; Supplier Part Number 2: 52K6817; Supplier 2: Newark; Supplier Part Number 3: 71-CRCW0402-20K-E3; Supplier 3: Mouser; RoHS: E; Value1: 1%; MountType: SMT; Supplier 1: Digi-Key; PackageReference: 0402; Tolerance_%: 1%; SizeArea_mm2: 0.5; CompType: Resistor; PartNumber: CRCW040220K0FKED; ComponentLink1Description: Datasheet link; Supplier Part Number 1: 541-20.0KLCT-ND; Technology: Thick Film
R31 = CMP-0026646-1: RES, 0.91, 1%, 0.125 W, 0402; Manufacturer: Panasonic; Power_W: 125mW; TempCo: 250 ppm/C; Value_Code: R910; U/M: EA; Value: 0.91; EIA_Code: E96; Res_ohm: 9.1d; SizeX_mm: 1; SizeY_mm: 0.5; SizeZ_mm: 0.6; Value2: 0.125W; AEC Category: Q200; ComponentLink1URL: http://www.panasonic.com/industrial/components/pdf/AOA0000CE3.pdf; Supplier Part Number 2: 667-ERJ-2BQFR91X; Publisher: Texas Instruments; Supplier 2: Mouser; Published: 2008-06-26; RoHS: Y; Value1: 1%; MountType: SMT; Supplier 1: Digi-Key; PackageReference: 0402; Tolerance_%: 1%; SizeArea_mm2: 0.5; CompType: Resistor; LatestRevisionDate: 2017-03-09; PartNumber: ERJ-2BQFR91X; AEC Qualified: ?; ComponentLink1Description: Datasheet link; Supplier Part Number 1: P.91AKCT-ND; Technology: Thick Film
R32 R36-R38 R40-R42 = CMP-0026193-2: RES SMD 249K OHM 1% 1/16W 0402; Manufacturer: Yageo; Power_W: 63mW; TempCo: 100 ppm/C; EIA_Code: E96; SizeX_mm: 1; SizeY_mm: 0.5; SizeZ_mm: 0.6; Value2: 0.063W; AEC Qualified: Y; VDC_V: 50V; AEC Category: Q200; AEC Grade: 0; ComponentLink1URL: http://www.vishay.com/docs/20035/dcrcwe3.pdf; Supplier 2: Newark; Supplier 3: Mouser; Value_Code: 249k; RoHS: E; Value1: 1%; MountType: SMT; Value: 249k; Supplier 1: Digi-Key; PackageReference: 0402; Tolerance_%: 1%; Res_ohm: 249k; SizeArea_mm2: 0.5; CompType: Resistor; PartNumber: RC0402FR-07249KL; ComponentLink1Description: Datasheet link; Supplier Part Number 1: 311-249KLRCT-ND; Technology: Thick Film
R33 = CMP-0081046-1: RES, 133 k, 1%, 0.063 W, AEC-Q200 Grade 0, 0402; Manufacturer: Yageo America; Power_W: 63mW; TempCo: 100 ppm/C; SizeAreaWB_mm2: 3; Value: 133k; EIA_Code: E96; SizeX_mm: 1; SizeY_mm: 0.5; SizeZ_mm: 0.6; Value2: 0.063W; AEC Qualified: Y; VDC_V: 50V; AEC Grade: 0; AEC Category: Q200; ComponentLink1URL: http://www.yageo.com/NewPortal/yageodocoutput?fileName=/pdf/R-Chip/PYu-AC_51_RoHS_L_6.pdf; Supplier Part Number 2: 603-AC0402FR-07133KL; Supplier 2: Mouser; Value_Code: 133k; RoHS: Y; Value1: 1%; MountType: SMT; Supplier 1: Digi-Key; PackageReference: 0402; Tolerance_%: 1%; Res_ohm: 133k; SizeArea_mm2: 0.5; CompType: Resistor; PartNumber: AC0402FR-07133KL; ComponentLink1Description: Datasheet link; Supplier Part Number 1: YAG5259CT-ND; Technology: Thick Film
R34 = CMP-0026405-2: RES SMD 4.02K OHM 1% 1/16W 0402; Manufacturer: Yageo; Power_W: 63mW; TempCo: 100 ppm/C; Value_Code: 4k02; EIA_Code: E96; SizeX_mm: 1; SizeY_mm: 0.5; SizeZ_mm: 0.6; Value2: 0.063W; AEC Qualified: Y; VDC_V: 50V; AEC Category: Q200; AEC Grade: 0; ComponentLink1URL: http://www.vishay.com/docs/20035/dcrcwe3.pdf; Supplier 2: Newark; Supplier 3: Mouser; RoHS: E; Value1: 1%; MountType: SMT; Value: 4.02k; Supplier 1: Digi-Key; PackageReference: 0402; Tolerance_%: 1%; Res_ohm: 4.02k; SizeArea_mm2: 0.5; CompType: Resistor; PartNumber: RC0402FR-074K02L; ComponentLink1Description: Datasheet link; Supplier Part Number 1: 311-4.02KLRCT-ND; Technology: Thick Film
R35 R39 R48 = CMP-0026245-2: RES, 2.00 M, 1%, 0.063 W, AEC-Q200 Grade 0, 0402; Manufacturer: Vishay-Dale; Power_W: 63mW; TempCo: 100 ppm/C; Value_Code: 2M00; Value: 2.00Meg; EIA_Code: E96; Res_ohm: 2M; SizeX_mm: 1; SizeY_mm: 0.5; SizeZ_mm: 0.6; Value2: 0.063W; AEC Qualified: Y; VDC_V: 50V; AEC Category: Q200; AEC Grade: 0; ComponentLink1URL: http://www.vishay.com/docs/20035/dcrcwe3.pdf; Supplier Part Number 2: 52K6816; Supplier 2: Newark; Supplier Part Number 3: 71-CRCW0402-2M-E3; Supplier 3: Mouser; RoHS: E; Value1: 1%; MountType: SMT; Supplier 1: Digi-Key; PackageReference: 0402; Tolerance_%: 1%; SizeArea_mm2: 0.5; CompType: Resistor; PartNumber: CRCW04022M00FKED; ComponentLink1Description: Datasheet link; Supplier Part Number 1: 541-2.00MLCT-ND; Technology: Thick Film
R43 = CMP-0026712-1: RES, 97.6 k, 1%, 0.1 W, AEC-Q200 Grade 0, 0402; Manufacturer: Panasonic; Power_W: 100mW; TempCo: 100 ppm/C; Value_Code: 97k6; U/M: EA; Value: 97.6k; EIA_Code: E96; SizeX_mm: 1; SizeY_mm: 0.5; SizeZ_mm: 0.6; Value2: 0.1W; AEC Qualified: Y; VDC_V: 50V; AEC Grade: 0; AEC Category: Q200; ComponentLink1URL: http://industrial.panasonic.com/cdbs/www-data/pdf/RDA0000/AOA0000CE2.pdf; Supplier Part Number 2: 53W4505; Publisher: Texas Instruments; Supplier 2: Newark; Supplier Part Number 3: 667-ERJ-2RKF9762X; Supplier 3: Mouser; Published: 2008-06-26; RoHS: Y; Value1: 1%; MountType: SMT; Supplier 1: Digi-Key; PackageReference: 0402; Tolerance_%: 1%; Res_ohm: 97.6k; SizeArea_mm2: 0.5; CompType: Resistor; LatestRevisionDate: 2017-03-09; PartNumber: ERJ-2RKF9762X; ComponentLink1Description: Datasheet link; Supplier Part Number 1: P97.6KLCT-ND; Technology: Thick Film
R44-R46 = CMP-0026186-2: RES SMD 23.2K OHM 1% 1/16W 0402; Manufacturer: Yageo; Power_W: 63mW; TempCo: 100 ppm/C; Value_Code: 23k2; EIA_Code: E96; SizeX_mm: 1; SizeY_mm: 0.5; SizeZ_mm: 0.6; Value2: 0.063W; AEC Qualified: Y; VDC_V: 50V; AEC Category: Q200; AEC Grade: 0; ComponentLink1URL: http://www.vishay.com/docs/20035/dcrcwe3.pdf; Supplier 2: Newark; Supplier 3: Mouser; RoHS: E; Value1: 1%; MountType: SMT; Value: 23.2k; Supplier 1: Digi-Key; PackageReference: 0402; Tolerance_%: 1%; Res_ohm: 23.2k; SizeArea_mm2: 0.5; CompType: Resistor; PartNumber: RC0402FR-0723K2L; ComponentLink1Description: Datasheet link; Supplier Part Number 1: YAG3066TR-ND; Technology: Thick Film
R47 = CMP-0026675-1: RES, 191 k, 1%, 0.1 W, AEC-Q200 Grade 0, 0402; Manufacturer: Panasonic; Power_W: 100mW; TempCo: 100 ppm/C; U/M: EA; Value: 191k; EIA_Code: E96; SizeX_mm: 1; SizeY_mm: 0.5; SizeZ_mm: 0.6; Value2: 0.1W; AEC Qualified: Y; VDC_V: 50V; AEC Grade: 0; AEC Category: Q200; ComponentLink1URL: http://industrial.panasonic.com/cdbs/www-data/pdf/RDA0000/AOA0000CE2.pdf; Supplier Part Number 2: 53W4261; Publisher: Texas Instruments; Supplier 2: Newark; Supplier Part Number 3: 667-ERJ-2RKF1913X; Supplier 3: Mouser; Published: 2008-06-26; Value_Code: 191k; RoHS: Y; Value1: 1%; MountType: SMT; Supplier 1: Digi-Key; PackageReference: 0402; Tolerance_%: 1%; Res_ohm: 191k; SizeArea_mm2: 0.5; CompType: Resistor; LatestRevisionDate: 2017-03-09; PartNumber: ERJ-2RKF1913X; ComponentLink1Description: Datasheet link; Supplier Part Number 1: P191KLCT-ND; Technology: Thick Film
R49 = CMP-0026695-1: RES, 3.30 k, 1%, 0.1 W, AEC-Q200 Grade 0, 0402; Manufacturer: Panasonic; Power_W: 100mW; TempCo: 100 ppm/C; Value_Code: 3k30; U/M: EA; Value: 3.30k; Res_ohm: 3.3k; SizeX_mm: 1; SizeY_mm: 0.5; SizeZ_mm: 0.6; Value2: 0.1W; AEC Qualified: Y; VDC_V: 50V; AEC Grade: 0; AEC Category: Q200; ComponentLink1URL: http://industrial.panasonic.com/cdbs/www-data/pdf/RDA0000/AOA0000C86.pdf; Supplier Part Number 2: 64R5278; Publisher: Texas Instruments; Supplier 2: Newark; Supplier Part Number 3: 667-ERJ-2RKF3301X; Supplier 3: Mouser; Published: 2008-06-26; RoHS: Y; Value1: 1%; MountType: SMT; Supplier 1: Digi-Key; PackageReference: 0402; Tolerance_%: 1%; SizeArea_mm2: 0.5; CompType: Resistor; LatestRevisionDate: 2017-03-09; PartNumber: ERJ-2RKF3301X; ComponentLink1Description: Datasheet link; Supplier Part Number 1: P3.30KLCT-ND; Technology: Thick Film
U1 = CMP-0013784-3: 100-V Three-Phase Smart Gate Driver With Buck Regulator, RGZ0048L (VQFN-48); Alternate Manufacturer: Texas Instruments; CompType: IC; AEC Qualified: N; SizeX_mm: 7; SizeZ_mm: 1; SizeAreaWB_mm2: 81; Rating: Catalog; AEC Category: Q200; SizeArea_mm2: 49; ComponentLink2Description: Product Folder; MountType: SMT; ComponentLink3URL: http://www.ti.com/product/drv8350r/datasheet; RoHS: Y; ComponentLink3Description: Online Datasheet; ComponentLink1Description: Datasheet Link; PackageReference: RGZ0048L; Alternate PartNumber: DRV8350RHRGZT; PartNumber: DRV8350RHRGZT; PackageDescription: VQFN-48; Operating Temperature Range: -40 to 125 C; ComponentLink2URL: http://www.ti.com/product/drv8350r; SizeY_mm: 7; ComponentLink1URL: http://www.ti.com/lit/ds/symlink/drv8350r.pdf; Manufacturer: Texas Instruments
U5 = CMP-0013061-1: Low- and High-Side Measurement, Multichannel, Voltage Output, Current-Sense Amplifier, DBV0005A (SOT-5); Manufacturer: Texas Instruments; SizeZ_mm: 1.45; SizeX_mm: 2.8; SizeY_mm: 2.9; SizeArea_mm2: 8.12; CompType: IC; U/M: EA; SizeAreaWB_mm2: 14.82; ComponentLink1URL: https://sps06.itg.ti.com/sites/KMS/crossdivteams/altium/docs/ComponentDatasheets/INA180.pdf; Publisher: Texas Instruments; PackageDescription: SOT-5; PackageReference: DBV0005A; LatestRevisionDate: 2017-03-09; Footprint Path 6: C:\AltiumLibraries\Footprints\TI\.PcbLib; MountType: SMT; ComponentLink1Description: Datasheet Link; Alternate Manufacturer: Texas Instruments